# EAGLE schematic pcb_board_doorsecurity (EAGLE 9.6.2)
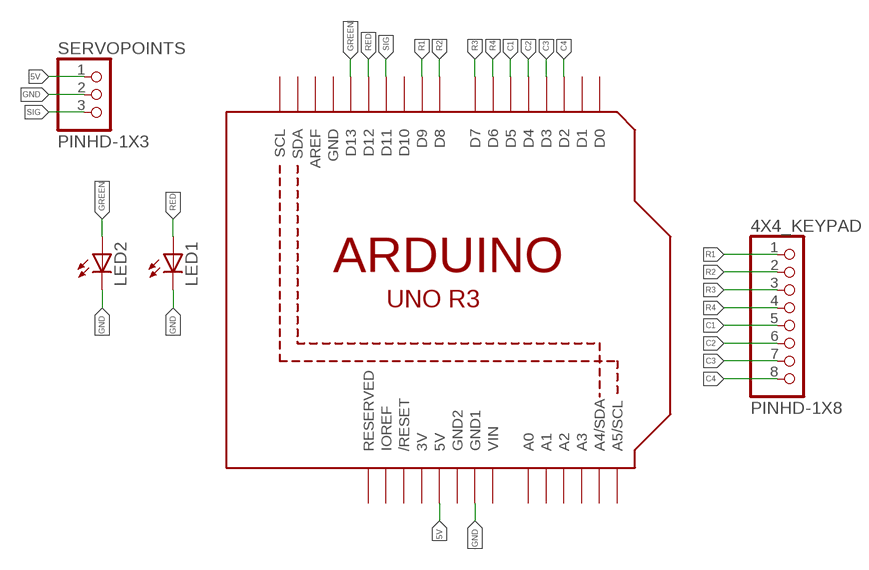
[diagram p0: schematic, sheet 1]

## Parts
4X4_KEYPAD  PINHD-1X8  [1X08]
LED1  LED5MM  [LED5MM]
LED2  LED5MM  [LED5MM]
SERVOPOINTS  PINHD-1X3  [1X03]
U1  ARDUINOR3-BPLACE  [ARDUINOR3-BPLACE]

## Nets
5V: SERVOPOINTS.1 U1.5V
C1: 4X4_KEYPAD.5 U1.D5
C2: 4X4_KEYPAD.6 U1.D4
C3: 4X4_KEYPAD.7 U1.D3
C4: 4X4_KEYPAD.8 U1.D2
GND: LED1.K(C) LED2.K(C) SERVOPOINTS.2 U1.GND1
GREEN: LED2.A U1.D13
R1: 4X4_KEYPAD.1 U1.D9
R2: 4X4_KEYPAD.2 U1.D8
R3: 4X4_KEYPAD.3 U1.D7
R4: 4X4_KEYPAD.4 U1.D6
RED: LED1.A U1.D12
SIG: SERVOPOINTS.3 U1.D11
Unconnected: U1.A0 U1.A1 U1.A2 U1.A3 U1.A4(A4/SDA) U1.A5(A5/SCL) U1.AREF U1.D0 U1.D1 U1.D10 U1.IOREF U1.RESERVED U1.RESET(/RESET) U1.SCL U1.SDA

## Power pins joined to a net without a drawn wire
3V: U1.3V
GND: U1.GND
GND2: U1.GND2
VIN: U1.VIN

## Library data of the parts
4X4_KEYPAD = Connector:PINHD-1X8: PIN HEADER; CATEGORY: CONNECTOR; SUB-CATEGORY: PIN-HEADER
LED1 LED2 = adafruit:LED: LED OSRAM: - CHIPLED LG R971, LG N971, LY N971, LG Q971, LY Q971, LO R971, LY R971 LH N974, LH R974 LS Q976, LO Q976, LY Q976 LO Q996 - Hyper CHIPLED LW Q18S LB Q993, LB Q99A, LB R99A - SideLED LS A670, LO A670, LY A670, LG A670, LP A670 LB A673, LV A673, LT A673, LW A673 LH A674 LY A675 LS A676, LA A676, LO A676, LY A676, LW A676 LS A679, LY A679, LG A679 - Hyper Micro SIDELED® LS Y876, LA Y876, LO Y876, LY Y876 LT Y87S - SmartLED LW L88C, LW L88S LB L89C, LB L89S, LG L890 LS L89K, LO L89K, LY L89K LS L896, LA L896, LO L896, LY L896 - TOPLED LS T670, LO T670, LY T670, LG T670, LP T670 LSG T670, LSP T670, LSY T670, LOP T670, LYG T670 LG T671, LOG T671, LSG T671 LB T673, LV T673, LT T673, LW T673 LH T674 LS T676, LA T676, LO T676, LY T676, LB T676, LH T676, LSB T676, LW T676 LB T67C, LV T67C, LT T67C, LS T67K, LO T67K, LY T67K, LW E67C LS E67B, LA E67B, LO E67B, LY E67B, LB E67C, LV E67C, LT E67C LW T67C LS T679, LY T679, LG T679 LS T770, LO T770, LY T770, LG T770, LP T770 LB T773, LV T773, LT T773, LW T773 LH T774 LS E675, LA E675, LY E675, LS T675 LS T776, LA T776, LO T776, LY T776, LB T776 LHGB T686 LT T68C, LB T68C - Hyper Mini TOPLED® LB M676 - Mini TOPLED Santana® LG M470 LS M47K, LO M47K, LY M47K Source: http://www.osram.convergy.de/
SERVOPOINTS = Connector:PINHD-1X3: PIN HEADER; CATEGORY: CONNECTOR; SUB-CATEGORY: PIN-HEADER
U1 = adafruit:ARDUINOR3: This is a new object for the new Arduino R3 - with extra pins that you may want to use (such as IOref, and duplicated A4/A5